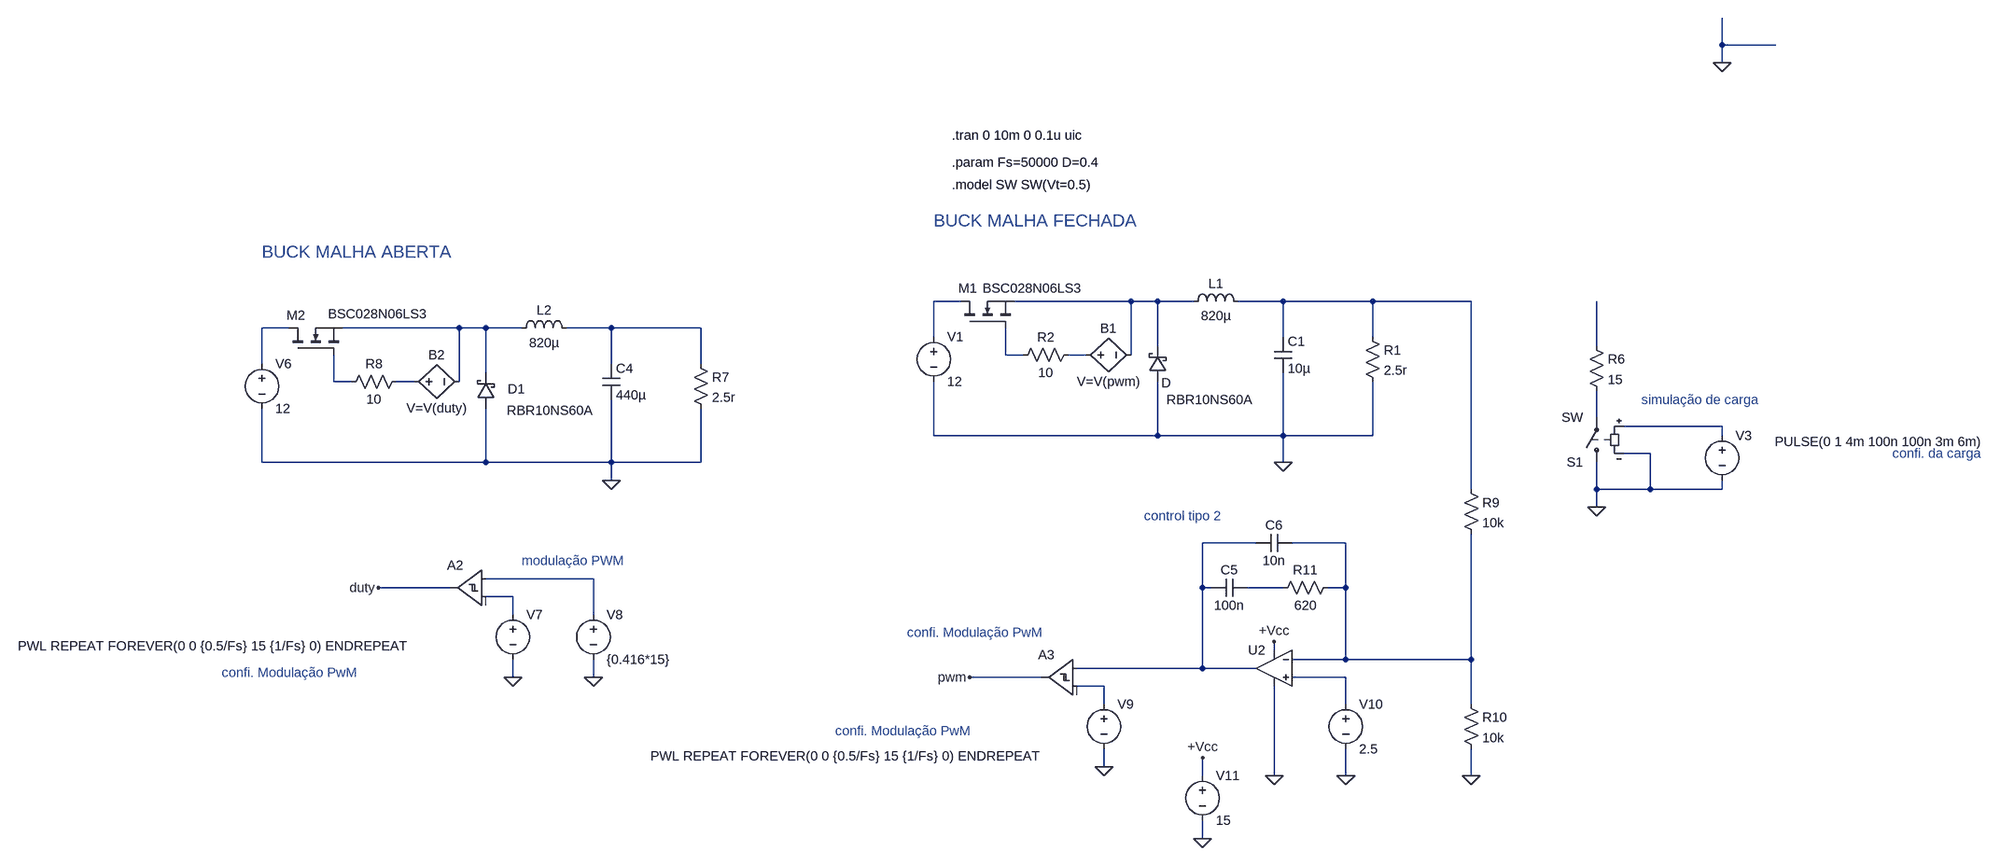
[diagram p0: schematic Buck_AFM_MG.asc]
Buck_AFM_MG.asc, the LTspice schematic file:
Version 4.1
SHEET 1 3020 2228
WIRE 1168 -1184 1168 -1232
WIRE 1264 -1184 1168 -1184
WIRE 1168 -1152 1168 -1184
WIRE -192 16 -240 16
WIRE 112 16 -96 16
WIRE 160 16 112 16
WIRE 224 16 160 16
WIRE 384 16 304 16
WIRE 544 16 384 16
WIRE 720 16 544 16
WIRE -1392 64 -1440 64
WIRE -1088 64 -1296 64
WIRE -1040 64 -1088 64
WIRE -976 64 -1040 64
WIRE -816 64 -896 64
WIRE -656 64 -816 64
WIRE -240 80 -240 16
WIRE 384 80 384 16
WIRE 544 80 544 16
WIRE 160 96 160 16
WIRE 944 96 944 16
WIRE -112 112 -112 64
WIRE -80 112 -112 112
WIRE 32 112 0 112
WIRE 112 112 112 16
WIRE -1440 128 -1440 64
WIRE -816 128 -816 64
WIRE -656 128 -656 64
WIRE -1040 144 -1040 64
WIRE -1312 160 -1312 112
WIRE -1280 160 -1312 160
WIRE -1168 160 -1200 160
WIRE -1088 160 -1088 64
WIRE 944 224 944 176
WIRE 1168 240 992 240
WIRE -240 256 -240 160
WIRE 160 256 160 160
WIRE 160 256 -240 256
WIRE 384 256 384 144
WIRE 384 256 160 256
WIRE 544 256 544 160
WIRE 544 256 384 256
WIRE 1168 256 1168 240
WIRE 1040 288 992 288
WIRE -1440 304 -1440 208
WIRE -1040 304 -1040 208
WIRE -1040 304 -1440 304
WIRE -816 304 -816 192
WIRE -816 304 -1040 304
WIRE -656 304 -656 208
WIRE -656 304 -816 304
WIRE 384 304 384 256
WIRE -816 336 -816 304
WIRE 720 352 720 16
WIRE 944 352 944 304
WIRE 1040 352 1040 288
WIRE 1040 352 944 352
WIRE 1168 352 1168 336
WIRE 1168 352 1040 352
WIRE 944 384 944 352
WIRE 336 448 240 448
WIRE 496 448 400 448
WIRE -848 512 -1040 512
WIRE -1104 528 -1232 528
WIRE 240 528 240 448
WIRE 256 528 240 528
WIRE 384 528 320 528
WIRE 496 528 496 448
WIRE 496 528 464 528
WIRE -992 544 -1040 544
WIRE -992 576 -992 544
WIRE -848 576 -848 512
WIRE 368 640 368 624
WIRE 496 656 496 528
WIRE 496 656 400 656
WIRE 720 656 720 432
WIRE 720 656 496 656
WIRE 240 672 240 528
WIRE 240 672 16 672
WIRE 336 672 240 672
WIRE -992 688 -992 656
WIRE -848 688 -848 656
WIRE -48 688 -176 688
WIRE 496 688 400 688
WIRE 64 704 16 704
WIRE 64 736 64 704
WIRE 496 736 496 688
WIRE 720 736 720 656
WIRE 64 848 64 816
WIRE 240 864 240 832
WIRE 368 864 368 704
WIRE 496 864 496 816
WIRE 720 864 720 816
WIRE 240 976 240 944
FLAG -816 336 0
FLAG -992 688 0
FLAG -1232 528 duty
FLAG -848 688 0
FLAG 944 384 0
FLAG 64 848 0
FLAG -176 688 pwm
FLAG 720 864 0
FLAG 496 864 0
FLAG 368 864 0
FLAG 240 976 0
FLAG 240 832 +Vcc
FLAG 368 624 +Vcc
FLAG 1168 -1152 0
FLAG 384 304 0
SYMBOL ind 208 32 R270
WINDOW 0 32 56 VTop 2
WINDOW 3 5 56 VBottom 2
SYMATTR InstName L1
SYMATTR Value 820µ
SYMBOL cap 368 80 R0
SYMATTR InstName C1
SYMATTR Value 10µ
SYMATTR SpiceLine Rser=5m
SYMBOL res 528 64 R0
SYMATTR InstName R1
SYMATTR Value 2.5r
SYMBOL voltage -240 64 R0
WINDOW 123 0 0 Left 0
WINDOW 39 0 0 Left 0
SYMATTR InstName V1
SYMATTR Value 12
SYMBOL schottky 176 160 R180
WINDOW 0 -8 -2 Left 2
WINDOW 3 -153 -32 Left 2
SYMATTR InstName D
SYMATTR Value RBR10NS60A
SYMATTR Description Diode
SYMATTR Type diode
SYMBOL bv 16 112 R270
WINDOW 0 32 56 VTop 2
WINDOW 3 -32 56 VBottom 2
SYMATTR InstName B1
SYMATTR Value V=V(pwm)
SYMBOL res 16 96 R90
WINDOW 0 0 56 VBottom 2
WINDOW 3 32 56 VTop 2
SYMATTR InstName R2
SYMATTR Value 10
SYMBOL nmos -192 64 R270
WINDOW 0 71 -4 VRight 2
WINDOW 3 71 39 VRight 2
SYMATTR InstName M1
SYMATTR Value BSC028N06LS3
SYMBOL ind -992 80 R270
WINDOW 0 32 56 VTop 2
WINDOW 3 5 56 VBottom 2
SYMATTR InstName L2
SYMATTR Value 820µ
SYMBOL cap -832 128 R0
SYMATTR InstName C4
SYMATTR Value 440µ
SYMATTR SpiceLine Rser=5m
SYMBOL res -672 112 R0
SYMATTR InstName R7
SYMATTR Value 2.5r
SYMBOL voltage -1440 112 R0
WINDOW 123 0 0 Left 0
WINDOW 39 0 0 Left 0
SYMATTR InstName V6
SYMATTR Value 12
SYMBOL schottky -1024 208 R180
WINDOW 0 -54 35 Left 2
WINDOW 3 -174 -3 Left 2
SYMATTR InstName D1
SYMATTR Value RBR10NS60A
SYMATTR Description Diode
SYMATTR Type diode
SYMBOL bv -1184 160 R270
WINDOW 0 32 56 VTop 2
WINDOW 3 -32 56 VBottom 2
SYMATTR InstName B2
SYMATTR Value V=V(duty)
SYMBOL res -1184 144 R90
WINDOW 0 0 56 VBottom 2
WINDOW 3 32 56 VTop 2
SYMATTR InstName R8
SYMATTR Value 10
SYMBOL nmos -1392 112 R270
WINDOW 0 71 -4 VRight 2
WINDOW 3 73 70 VRight 2
SYMATTR InstName M2
SYMATTR Value BSC028N06LS3
SYMBOL voltage -992 560 R0
WINDOW 3 -884 72 Left 2
SYMATTR Value PWL REPEAT FOREVER(0 0 {0.5/Fs} 15 {1/Fs} 0) ENDREPEAT
SYMATTR InstName V7
SYMBOL Digital\\diffschmtbuf -1040 464 M0
WINDOW 3 40 110 Invisible 2
SYMATTR Value Vhigh=15 Vlow=0 Ref=0
SYMATTR InstName A2
SYMBOL voltage -848 560 R0
WINDOW 123 0 0 Left 0
WINDOW 39 0 0 Left 0
SYMATTR InstName V8
SYMATTR Value {0.416*15}
SYMBOL res 928 80 R0
SYMATTR InstName R6
SYMATTR Value 15
SYMBOL sw 944 320 R180
SYMATTR InstName S1
SYMBOL voltage 1168 240 R0
WINDOW 123 0 0 Left 0
WINDOW 39 0 0 Left 0
WINDOW 3 94 27 Left 2
SYMATTR Value PULSE(0 1 4m 100n 100n 3m 6m)
SYMATTR InstName V3
SYMBOL voltage 64 720 R0
WINDOW 3 -810 109 Left 2
SYMATTR Value PWL REPEAT FOREVER(0 0 {0.5/Fs} 15 {1/Fs} 0) ENDREPEAT
SYMATTR InstName V9
SYMBOL Digital\\diffschmtbuf 16 624 M0
WINDOW 3 40 110 Invisible 2
SYMATTR Value Vhigh=15 Vlow=0 Ref=0
SYMATTR InstName A3
SYMBOL res 704 336 R0
SYMATTR InstName R9
SYMATTR Value 10k
SYMBOL res 704 720 R0
SYMATTR InstName R10
SYMATTR Value 10k
SYMBOL OpAmps\\UniversalOpamp2 368 672 M0
SYMATTR InstName U2
SYMBOL voltage 496 720 R0
WINDOW 123 0 0 Left 0
WINDOW 39 0 0 Left 0
SYMATTR InstName V10
SYMATTR Value 2.5
SYMBOL voltage 240 848 R0
WINDOW 123 0 0 Left 0
WINDOW 39 0 0 Left 0
SYMATTR InstName V11
SYMATTR Value 15
SYMBOL res 480 512 R90
WINDOW 0 0 56 VBottom 2
WINDOW 3 32 56 VTop 2
SYMATTR InstName R11
SYMATTR Value 620
SYMBOL cap 320 512 R90
WINDOW 0 0 32 VBottom 2
WINDOW 3 32 32 VTop 2
SYMATTR InstName C5
SYMATTR Value 100n
SYMBOL cap 400 432 R90
WINDOW 0 0 32 VBottom 2
WINDOW 3 32 32 VTop 2
SYMATTR InstName C6
SYMATTR Value 10n
TEXT -208 -280 Left 2 !.tran 0 10m 0 0.1u uic
TEXT -208 -232 Left 2 !.param Fs=50000 D=0.4
TEXT -208 -192 Left 2 !.model SW SW(Vt=0.5)
TEXT -1440 -72 Left 3 ;BUCK MALHA ABERTA
TEXT -240 -128 Left 3 ;BUCK MALHA FECHADA
TEXT -1512 680 Left 2 ;confi. Modulação PwM
TEXT 1024 192 Left 2 ;simulação de carga
TEXT -976 480 Left 2 ;modulação PWM
TEXT -288 608 Left 2 ;confi. Modulação PwM
TEXT 1472 288 Left 2 ;confi. da carga
TEXT 136 400 Left 2 ;control tipo 2
TEXT -416 784 Left 2 ;confi. Modulação PwM

The netlist it stands for:
* Buck_AFM_MG.asc
L1 N002 N003 820µ
C1 N003 0 10µ Rser=5m
R1 N003 0 2.5r
V1 N001 0 12
D 0 N002 RBR10NS60A
B1 N009 N002 V=V(pwm)
R2 N009 N008 10
M1 N001 N008 N002 N002 BSC028N06LS3
L2 N005 N006 820µ
C4 N006 0 440µ Rser=5m
R7 N006 0 2.5r
V6 N004 0 12
D1 0 N005 RBR10NS60A
B2 N011 N005 V=V(duty)
R8 N011 N010 10
M2 N004 N010 N005 N005 BSC028N06LS3
V7 N018 0 PWL REPEAT FOREVER(0 0 {0.5/Fs} 15 {1/Fs} 0) ENDREPEAT
A2 N016 N018 0 0 0 0 duty 0 SCHMITT Vhigh=15 Vlow=0 Ref=0
V8 N016 0 {0.416*15}
R6 N007 N012 15
S1 0 N012 N013 0 SW
V3 N013 0 PULSE(0 1 4m 100n 100n 3m 6m)
V9 N020 0 PWL REPEAT FOREVER(0 0 {0.5/Fs} 15 {1/Fs} 0) ENDREPEAT
A3 N014 N020 0 0 0 0 pwm 0 SCHMITT Vhigh=15 Vlow=0 Ref=0
R9 N003 N015 10k
R10 N015 0 10k
X§U2 N019 N015 +Vcc 0 N014 level.2 Avol=1Meg GBW=10Meg Slew=10Meg ilimit=25m rail=0 Vos=0 phimargin=45 en=0 enk=0 in=0 ink=0 Rin=500Meg  ; pins IN+ IN- V+ V- OUT
V10 N019 0 2.5
V11 +Vcc 0 15
R11 N015 N017 620
C5 N017 N014 100n
C6 N015 N014 10n
.model D D
.lib standard.dio
.model NMOS NMOS
.model PMOS PMOS
.lib standard.mos
.tran 0 10m 0 0.1u uic
.param Fs=50000 D=0.4
.model SW SW(Vt=0.5)
* BUCK MALHA ABERTA
* BUCK MALHA FECHADA
* confi. Modulação PwM
* simulação de carga
* modulação PWM
* confi. Modulação PwM
* confi. da carga
* control tipo 2
* confi. Modulação PwM
.lib UniversalOpamps2.sub
.backanno
.end